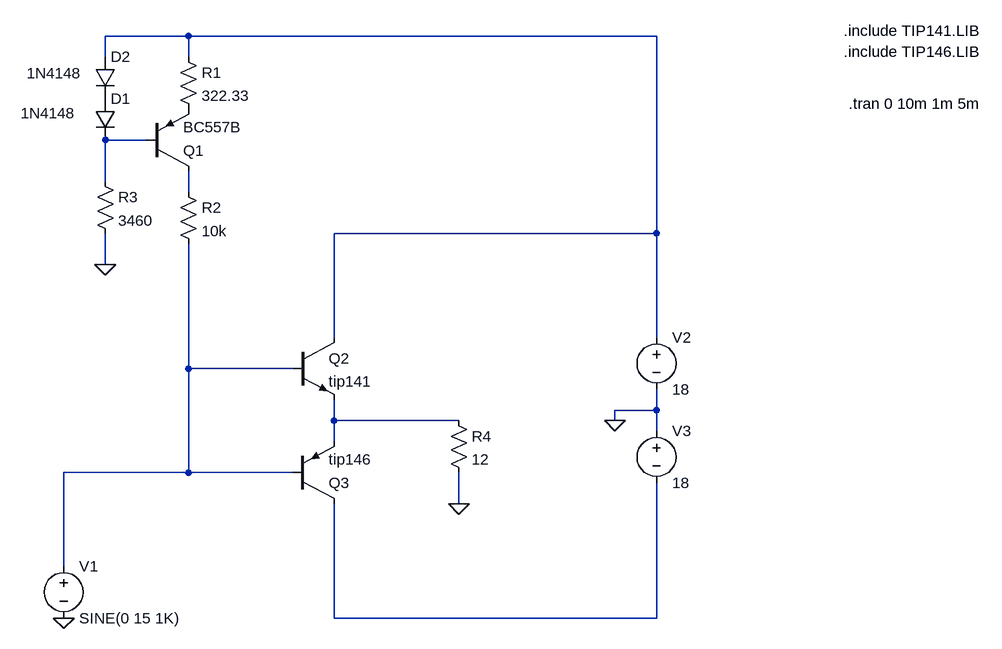
[diagram p0: schematic Draft1.asc]
Draft1.asc, the LTspice schematic file:
Version 4
SHEET 1 880 680
WIRE -688 -512 -816 -512
WIRE 32 -512 -688 -512
WIRE -816 -480 -816 -512
WIRE -688 -480 -688 -512
WIRE -752 -352 -816 -352
WIRE -816 -288 -816 -352
WIRE -688 -272 -688 -304
WIRE 32 -208 32 -512
WIRE 32 -208 -464 -208
WIRE -816 -160 -816 -208
WIRE -464 -48 -464 -208
WIRE 32 -48 32 -208
WIRE -688 0 -688 -192
WIRE -528 0 -688 0
WIRE 32 64 32 32
WIRE 32 64 -32 64
WIRE -464 80 -464 48
WIRE -272 80 -464 80
WIRE -32 80 -32 64
WIRE 32 96 32 64
WIRE -464 112 -464 80
WIRE -688 160 -688 0
WIRE -688 160 -880 160
WIRE -528 160 -688 160
WIRE -272 208 -272 160
WIRE -880 304 -880 160
WIRE -464 384 -464 208
WIRE 32 384 32 176
WIRE 32 384 -464 384
FLAG -816 -160 0
FLAG -880 384 0
FLAG -32 80 0
FLAG -272 208 0
SYMBOL diode -832 -416 R0
WINDOW 3 -114 23 Left 2
SYMATTR InstName D1
SYMATTR Value 1N4148
SYMBOL diode -832 -480 R0
WINDOW 3 -105 25 Left 2
SYMATTR InstName D2
SYMATTR Value 1N4148
SYMBOL res -704 -496 R0
SYMATTR InstName R1
SYMATTR Value 322.33
SYMBOL res -704 -288 R0
SYMATTR InstName R2
SYMATTR Value 10k
SYMBOL res -832 -304 R0
SYMATTR InstName R3
SYMATTR Value 3460
SYMBOL pnp -752 -304 M180
SYMATTR InstName Q1
SYMATTR Value BC557B
SYMBOL npn -528 -48 R0
SYMATTR InstName Q2
SYMATTR Value tip141
SYMATTR Prefix X
SYMBOL pnp -528 208 M180
SYMATTR InstName Q3
SYMATTR Value tip146
SYMATTR Prefix X
SYMBOL voltage -880 288 R0
WINDOW 123 0 0 Left 0
WINDOW 39 0 0 Left 0
SYMATTR InstName V1
SYMATTR Value SINE(0 15 1K)
SYMBOL voltage 32 -64 R0
WINDOW 123 0 0 Left 0
WINDOW 39 0 0 Left 0
SYMATTR InstName V2
SYMATTR Value 18
SYMBOL voltage 32 80 R0
WINDOW 123 0 0 Left 0
WINDOW 39 0 0 Left 0
SYMATTR InstName V3
SYMATTR Value 18
SYMBOL res -288 64 R0
SYMATTR InstName R4
SYMATTR Value 12
TEXT 328 -408 Left 2 !.tran 0 10m 1m 5m
TEXT 320 -520 Left 2 !.include TIP141.LIB
TEXT 320 -488 Left 2 !.include TIP146.LIB

The netlist it stands for:
* Draft1.asc
D1 P001 N002 1N4148
D2 N001 P001 1N4148
R1 N001 P002 322.33
R2 N003 N004 10k
R3 N002 0 3460
Q1 N003 N002 P002 0 BC557B
XQ2 N001 N004 N005 tip141  ; pins C B E
XQ3 N006 N004 N005 tip146  ; pins C B E
V1 N004 0 SINE(0 15 1K)
V2 N001 0 18
V3 0 N006 18
R4 N005 0 12
.model D D
.lib standard.dio
.model NPN NPN
.model PNP PNP
.lib standard.bjt
.tran 0 10m 1m 5m
.include TIP141.LIB
.include TIP146.LIB
.backanno
.end